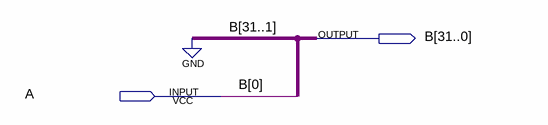
[diagram p0: schematic sheet]
// Quartus schematic Estende32B.bdf as structural Verilog: 0 symbols, 2 pins
module Estende32B (
  input  A,
  output [31:0] B
);


  assign B = {{31{1'b0}}, A};
endmodule
